# Altium schematic sheet _4_ETHERNET.SchDoc
size B
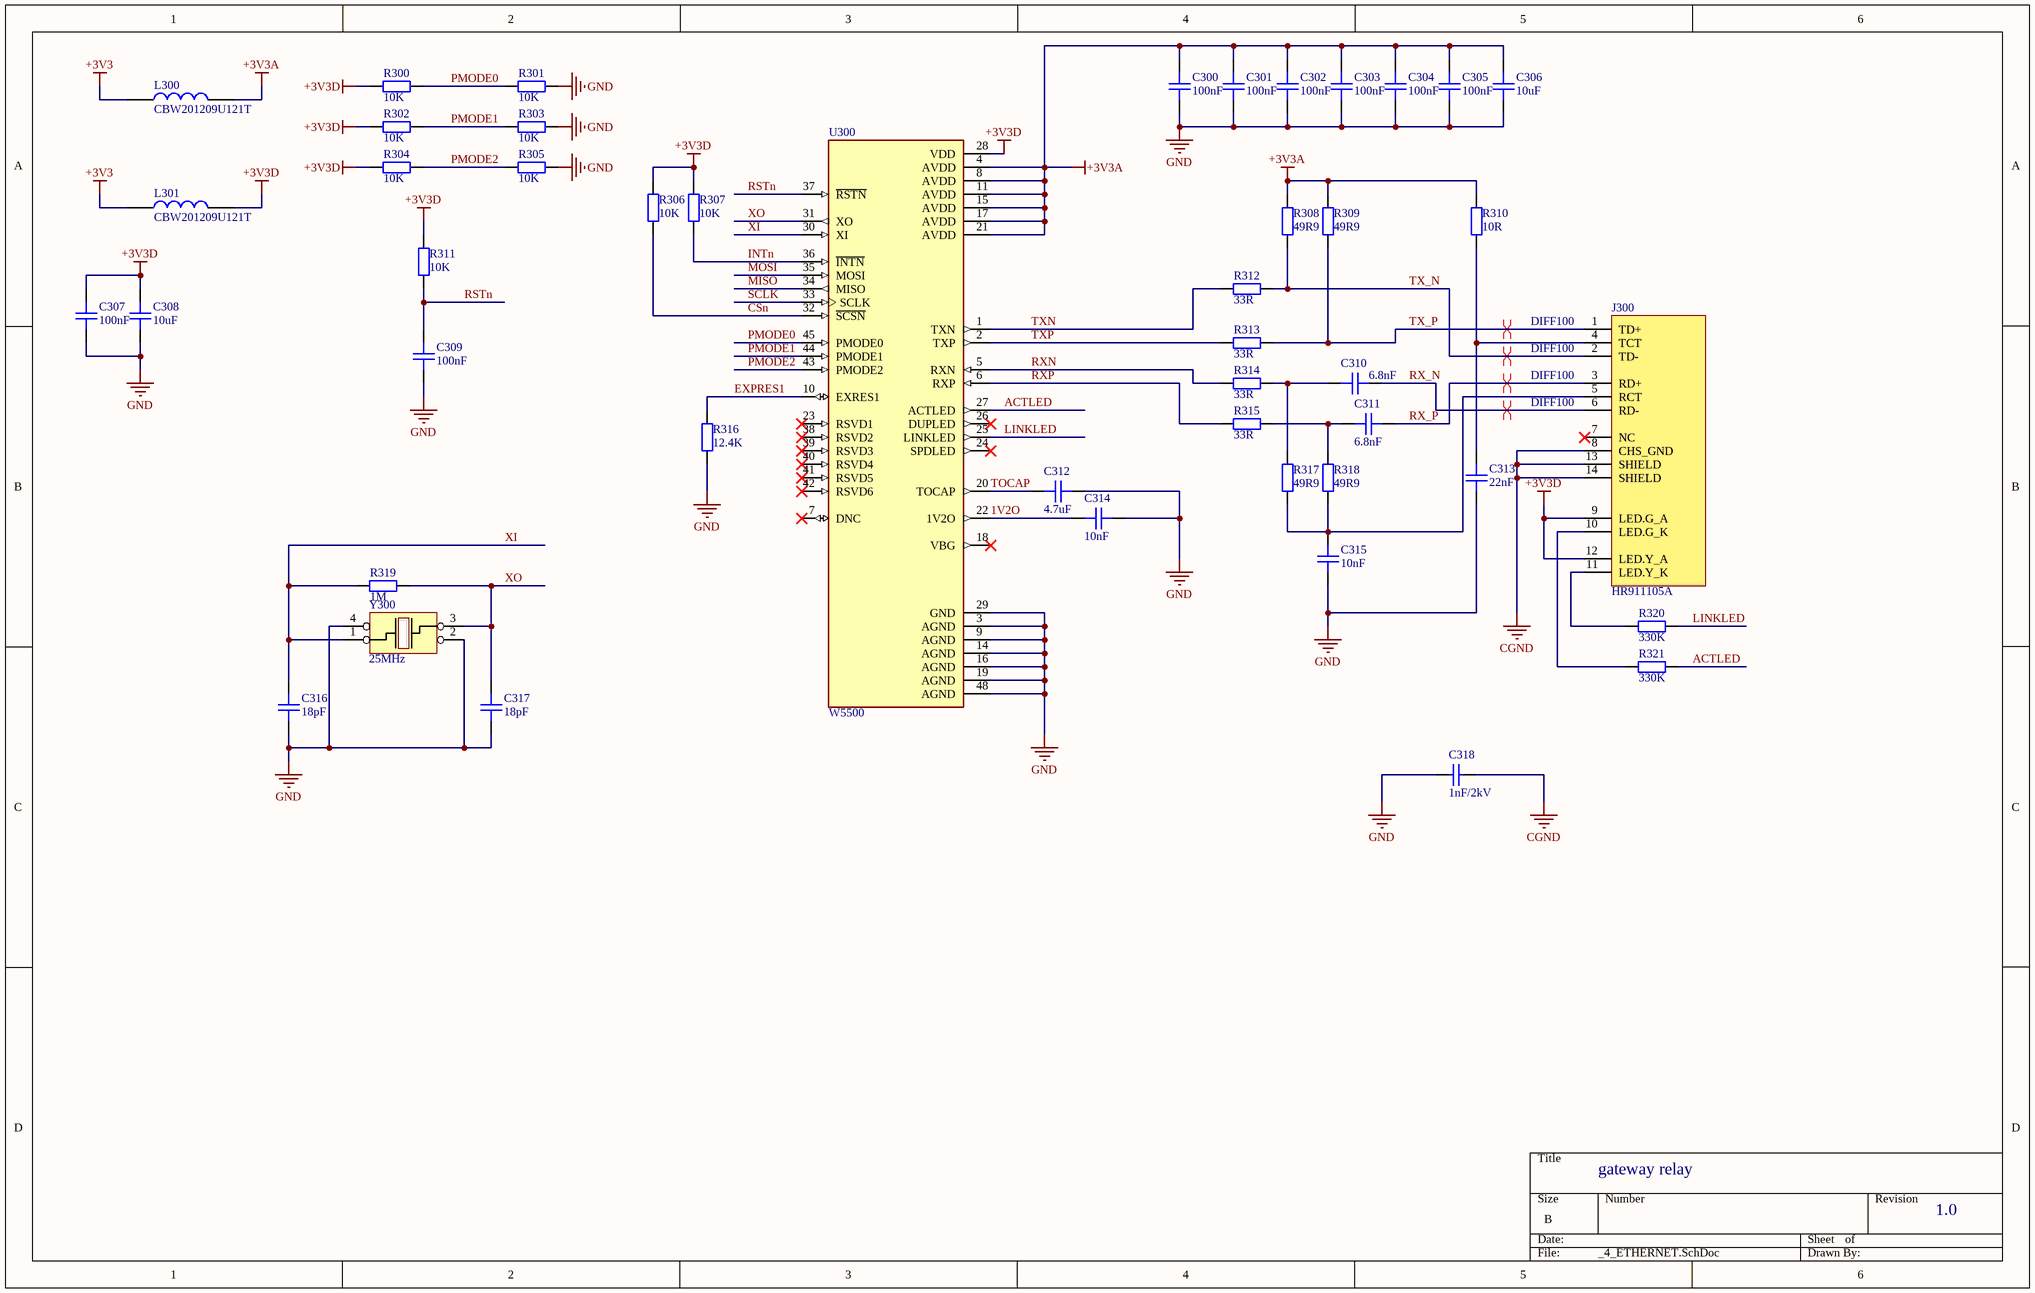
[diagram p0: _4_ETHERNET.SchDoc]

## Parts
C300  100nF  [CAPC-0603 (1608)]
C301  100nF  [CAPC-0603 (1608)]
C302  100nF  [CAPC-0603 (1608)]
C303  100nF  [CAPC-0603 (1608)]
C304  100nF  [CAPC-0603 (1608)]
C305  100nF  [CAPC-0603 (1608)]
C306  10uF  [CAPC-0603 (1608)]
C307  100nF  [CAPC-0603 (1608)]
C308  10uF  [CAPC-0603 (1608)]
C309  100nF  [CAPC-0603 (1608)]
C310  6.8nF  [CAPC-0603 (1608)]
C311  6.8nF  [CAPC-0603 (1608)]
C312  4.7uF  [CAPC-0603 (1608)]
C313  22nF  [CAPC-0603 (1608)]
C314  10nF  [CAPC-0603 (1608)]
C315  10nF  [CAPC-0603 (1608)]
C316  18pF  [CAPC-0603 (1608)]
C317  18pF  [CAPC-0603 (1608)]
C318  1nF/2kV  [tu 1206]
J300  HR911105A  [HR911105A]
L300  CBW201209U121T  [IND-0805 (2012)]
L301  CBW201209U121T  [IND-0805 (2012)]
R300  10K  [RESC-0603 (1608)]
R301  10K  [RESC-0603 (1608)]
R302  10K  [RESC-0603 (1608)]
R303  10K  [RESC-0603 (1608)]
R304  10K  [RESC-0603 (1608)]
R305  10K  [RESC-0603 (1608)]
R306  10K  [RESC-0603 (1608)]
R307  10K  [RESC-0603 (1608)]
R308  49R9  [RESC-0603 (1608)]
R309  49R9  [RESC-0603 (1608)]
R310  10R  [RESC-0603 (1608)]
R311  10K  [RESC-0603 (1608)]
R312  33R  [RESC-0603 (1608)]
R313  33R  [RESC-0603 (1608)]
R314  33R  [RESC-0603 (1608)]
R315  33R  [RESC-0603 (1608)]
R316  12.4K  [RESC-0603 (1608)]
R317  49R9  [RESC-0603 (1608)]
R318  49R9  [RESC-0603 (1608)]
R319  1M  [RESC-0603 (1608)]
R320  330K  [RESC-0603 (1608)]
R321  330K  [RESC-0603 (1608)]
U300  W5500  [QFP50P900X900X160-48N]
Y300  25MHz  [CRYSTALL_SMD_3225]

## Nets
+3V3: L300.2 L301.1
+3V3A: C300.2 C301.2 C302.2 C303.2 C304.2 C305.2 C306.2 L300.1 R308.2 R309.2 R310.2 U300.4(AVDD) U300.8(AVDD) U300.11(AVDD) U300.15(AVDD) U300.17(AVDD) U300.21(AVDD)
+3V3D: C307.2 C308.2 J300.9(LED.G_A) J300.12(LED.Y_A) L301.2 R300.1 R302.1 R304.1 R306.2 R307.2 R311.2 U300.28(VDD)
CGND: C318.1 J300.8(CHS_GND) J300.13(SHIELD) J300.14(SHIELD)
GND: C300.1 C301.1 C302.1 C303.1 C304.1 C305.1 C306.1 C307.1 C308.1 C309.1 C312.2 C313.1 C314.2 C315.1 C316.1 C317.1 C318.2 R301.2 R303.2 R305.2 R316.1 U300.3(AGND) U300.9(AGND) U300.14(AGND) U300.16(AGND) U300.19(AGND) U300.29(GND) U300.48(AGND) Y300.2 Y300.4
1V2O: C314.1 U300.22(1V2O)
ACTLED: R321.2 U300.27(ACTLED)
CSn: R306.1 U300.32(~{SCSN})
EXPRES1: R316.2 U300.10(EXRES1)
INTn: R307.1 U300.36(~{INTN})
LINKLED: R320.2 U300.25(LINKLED)
MISO: U300.34(MISO)
MOSI: U300.35(MOSI)
PMODE0: R300.2 R301.1 U300.45(PMODE0)
PMODE1: R302.2 R303.1 U300.44(PMODE1)
PMODE2: R304.2 R305.1 U300.43(PMODE2)
RSTn: C309.2 R311.1 U300.37(~{RSTN})
RX_N: C310.2 J300.6(RD-)
RX_P: C311.2 J300.3(RD+)
RXN: R314.1 U300.5(RXN)
RXP: R315.1 U300.6(RXP)
SCLK: U300.33(SCLK)
TOCAP: C312.1 U300.20(TOCAP)
TX_N: J300.2(TD-) R308.1 R312.2
TX_P: J300.1(TD+) R309.1 R313.2
TXN: R312.1 U300.1(TXN)
TXP: R313.1 U300.2(TXP)
XI: C316.2 R319.1 U300.30(XI) Y300.1
XO: C317.2 R319.2 U300.31(XO) Y300.3
NetC310_1: C310.1 R314.2 R317.2
NetC311_1: C311.1 R315.2 R318.2
NetC313_2: C313.2 J300.4(TCT) R310.1
NetC315_2: C315.2 J300.5(RCT) R317.1 R318.1
NetJ300_10: J300.10(LED.G_K) R321.1
NetJ300_11: J300.11(LED.Y_K) R320.1

Not connected (* = marked no-connect by the designer): J300 7(NC)*; U300 7(DNC)* 18(VBG)* 23(RSVD1)* 24(SPDLED)* 26(DUPLED)* 38(RSVD2)* 39(RSVD3)* 40(RSVD4)* 41(RSVD5)* 42(RSVD6)*

## Layout directives
differential pair; net class DIFF100: TX_N
differential pair; differential pair class DIFF100: RX_N, RX_P, TX_P

## Notes on the sheet
- gateway relay
- 1.0

## Library data of the parts
C300-C305 C307 C309 = CC0603KRX7R7BB105: CAP CER 1uF 10% 16V X7R 0603; Value: 105/16V; CompanyID: VT-00017; Solder: SMT; MPN: CC0603KRX7R7BB105; Category: CAPACITOR; PinCount: 2
C306 C308 = CC0603JRX7R9BB183: CAP CER 0.018UF 50V X7R 0603; MFR: Yageo; Value: 183/50V; Solder: SMT; MPN: CC0603JRX7R9BB183; Category: CAPACITOR; PinCount: 2
C310 C311 = CC0603JRX7R9BB682: CAP CER 6.8nF 5% 50V X7R 0603; CompanyID: VT-00669; Solder: SMT; Value: 682/50V; MPN: CC0603JRX7R9BB682; Category: CAPACITOR; PinCount: 2
C312 = CC0603JRNPO9BN471: CAP CER 470pF 50V 5% C0G/NPO 0603; Value: 471/50V; Solder: SMT; CompanyID: VT-01332; MPN: CC0603JRNPO9BN471; Category: CAPACITOR; PinCount: 2
C313 = CC0603KRX7R7BB224: CAP CER 0.22UF 16V X7R 0603; MFR: Yageo; Value: 224/16V; Solder: SMT; MPN: CC0603KRX7R7BB224; Category: CAPACITOR; PinCount: 2
C314 C315 = CC0603KRX7R7BB103: CAP CER 10nF 16V 10% X7R 0603; CompanyID: VT-00592; Solder: SMT; Value: 103/16V; MPN: CC0603KRX7R7BB103; Category: CAPACITOR; PinCount: 2
C316 C317 = CC0603JRNPO9BN181: CAP CER 180PF 50V 5% COG/NPO 0603; Solder: SMT; CompanyID: VT-01337; Value: 181/50V; MPN: CC0603JRNPO9BN181; Category: CAPACITOR; PinCount: 2
C318 = Tu 1206 470pF 50V 10%: Dán; Don_Vi: Con; So_Chan: 2; Ten_Linh_Kien: Tụ 1206 470P 10% 50V; Ma_Hang: MH004548; Chung_Loai: Dán; Kieu_Chan: *
J300 = HR911105A: Hanrun HR911105A RJ-45 Connector; Solder: WAVE; MPN: HR911105A; MFR: HanRun; Value: HR911105A
L300 L301 = MPZ2012S221A: IND-FERRITE BEAD 220 OHM 0805 1LN; CompanyID: VT-00253; Solder: SMT; Value: 220OHM/3A; MPN: MPZ2012S221A; Category: FERRITE BEAD; PinCount: 2
R300-R307 R311 = RC0603FR-0710KL: RES SMD 10K OHM 1% 1/10W 0603; CompanyID: VT-00328; Solder: SMT; MPN: RC0603FR-0710KL; Value: 10K; Category: RESISTOR
R308 R309 R317 R318 = RC0603FR-0749R9L: RES SMD 49.9 OHM 1% 1/10W 0603; MFR: Yageo; Solder: SMT; MPN: RC0603FR-0749R9L; Value: 49R9; Category: RESISTOR; PinCount: 2
R310 = RC0603FR-0710RL: RES SMD 10 OHM 1% 1/10W 0603; CompanyID: VT-00865; Solder: SMT; MPN: RC0603FR-0710RL; Value: 10R; Category: RESISTOR
R312-R315 = RC0603FR-0733RL: RES SMD 33 OHM 1% 1/10W 0603; MFR: Yageo; Solder: SMT; MPN: RC0603FR-0733RL; Value: 33R; Category: RESISTOR
R316 = RC0603FR-0712KL: RES SMD 12KOHM 1% 1/10W 0603; Solder: SMT; Value: 12K; CompanyID: *; MPN: RC0603FR-0712KL; Category: RESISTOR
R319 = RC0603FR-0710ML: RES SMD 10M OHM 1% 1/10W 0603; Solder: SMT; MPN: RC0603FR-0710ML; Value: 10M; Category: RESISTOR
R320 R321 = RC0603FR-07330KL: RES SMD 330K OHM 1% 1/10W 0603; Solder: SMT; CompanyID: VT-01025; MPN: RC0603FR-07330KL; Value: 330K; Category: RESISTOR
U300 = W5500: Hardwired TCP/IP embedded Ethernet controller; Availability: Unavailable; MP: W5500; Value: *; Price: None; Package: None
Y300 = ABM8G-25.000MHZ-18-D2Y-T: CRYSTAL 25.0000MHZ 18PF SMD; MFR: Abracon LLC; Solder: SMT; CompanyID: VT-xxx; MPN: ABM8G-25.000MHZ-18-D2Y-T; Value: 25MHz; Category: CRYSTAL